# Altium schematic sheet Sheet2.SchDoc
size A4
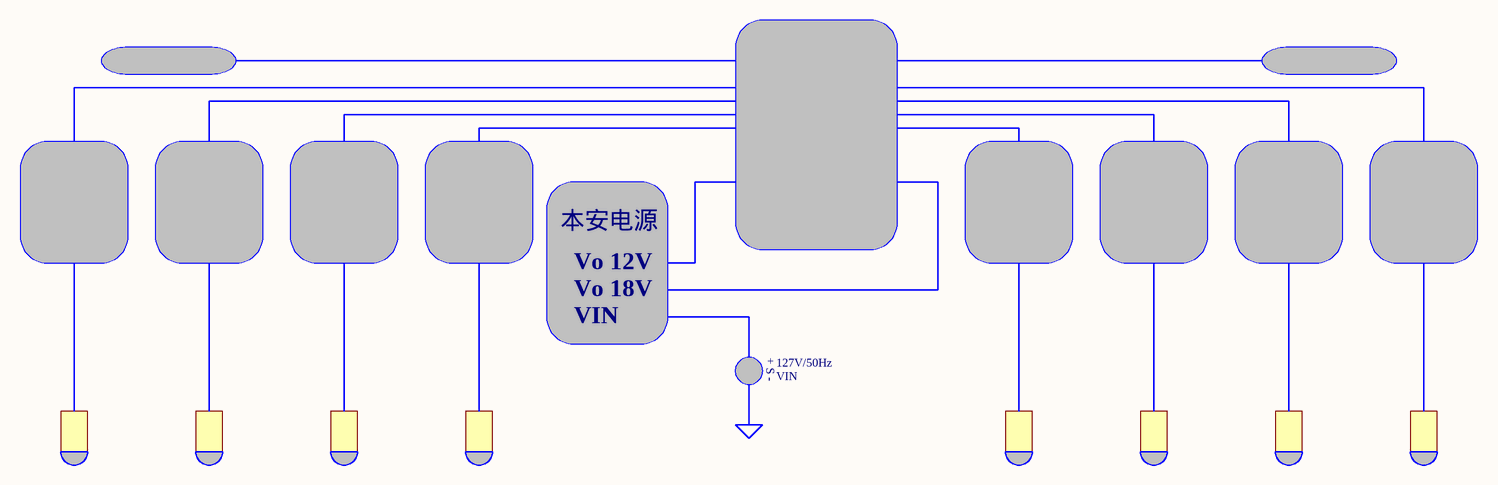
[diagram p0: Sheet2.SchDoc]

## Notes on the sheet
- 本安电源
- Vo 18V
- Vo 12V
- VIN
- + S -
- 127V/50Hz